# Altium project ZynTra.PrjPcb (part 2 of 2)

## Sheet 8_Zyntra-Ethernet.SchDoc
size 406 x 241 mm; SheetNumber: 8; SheetTotal: 10
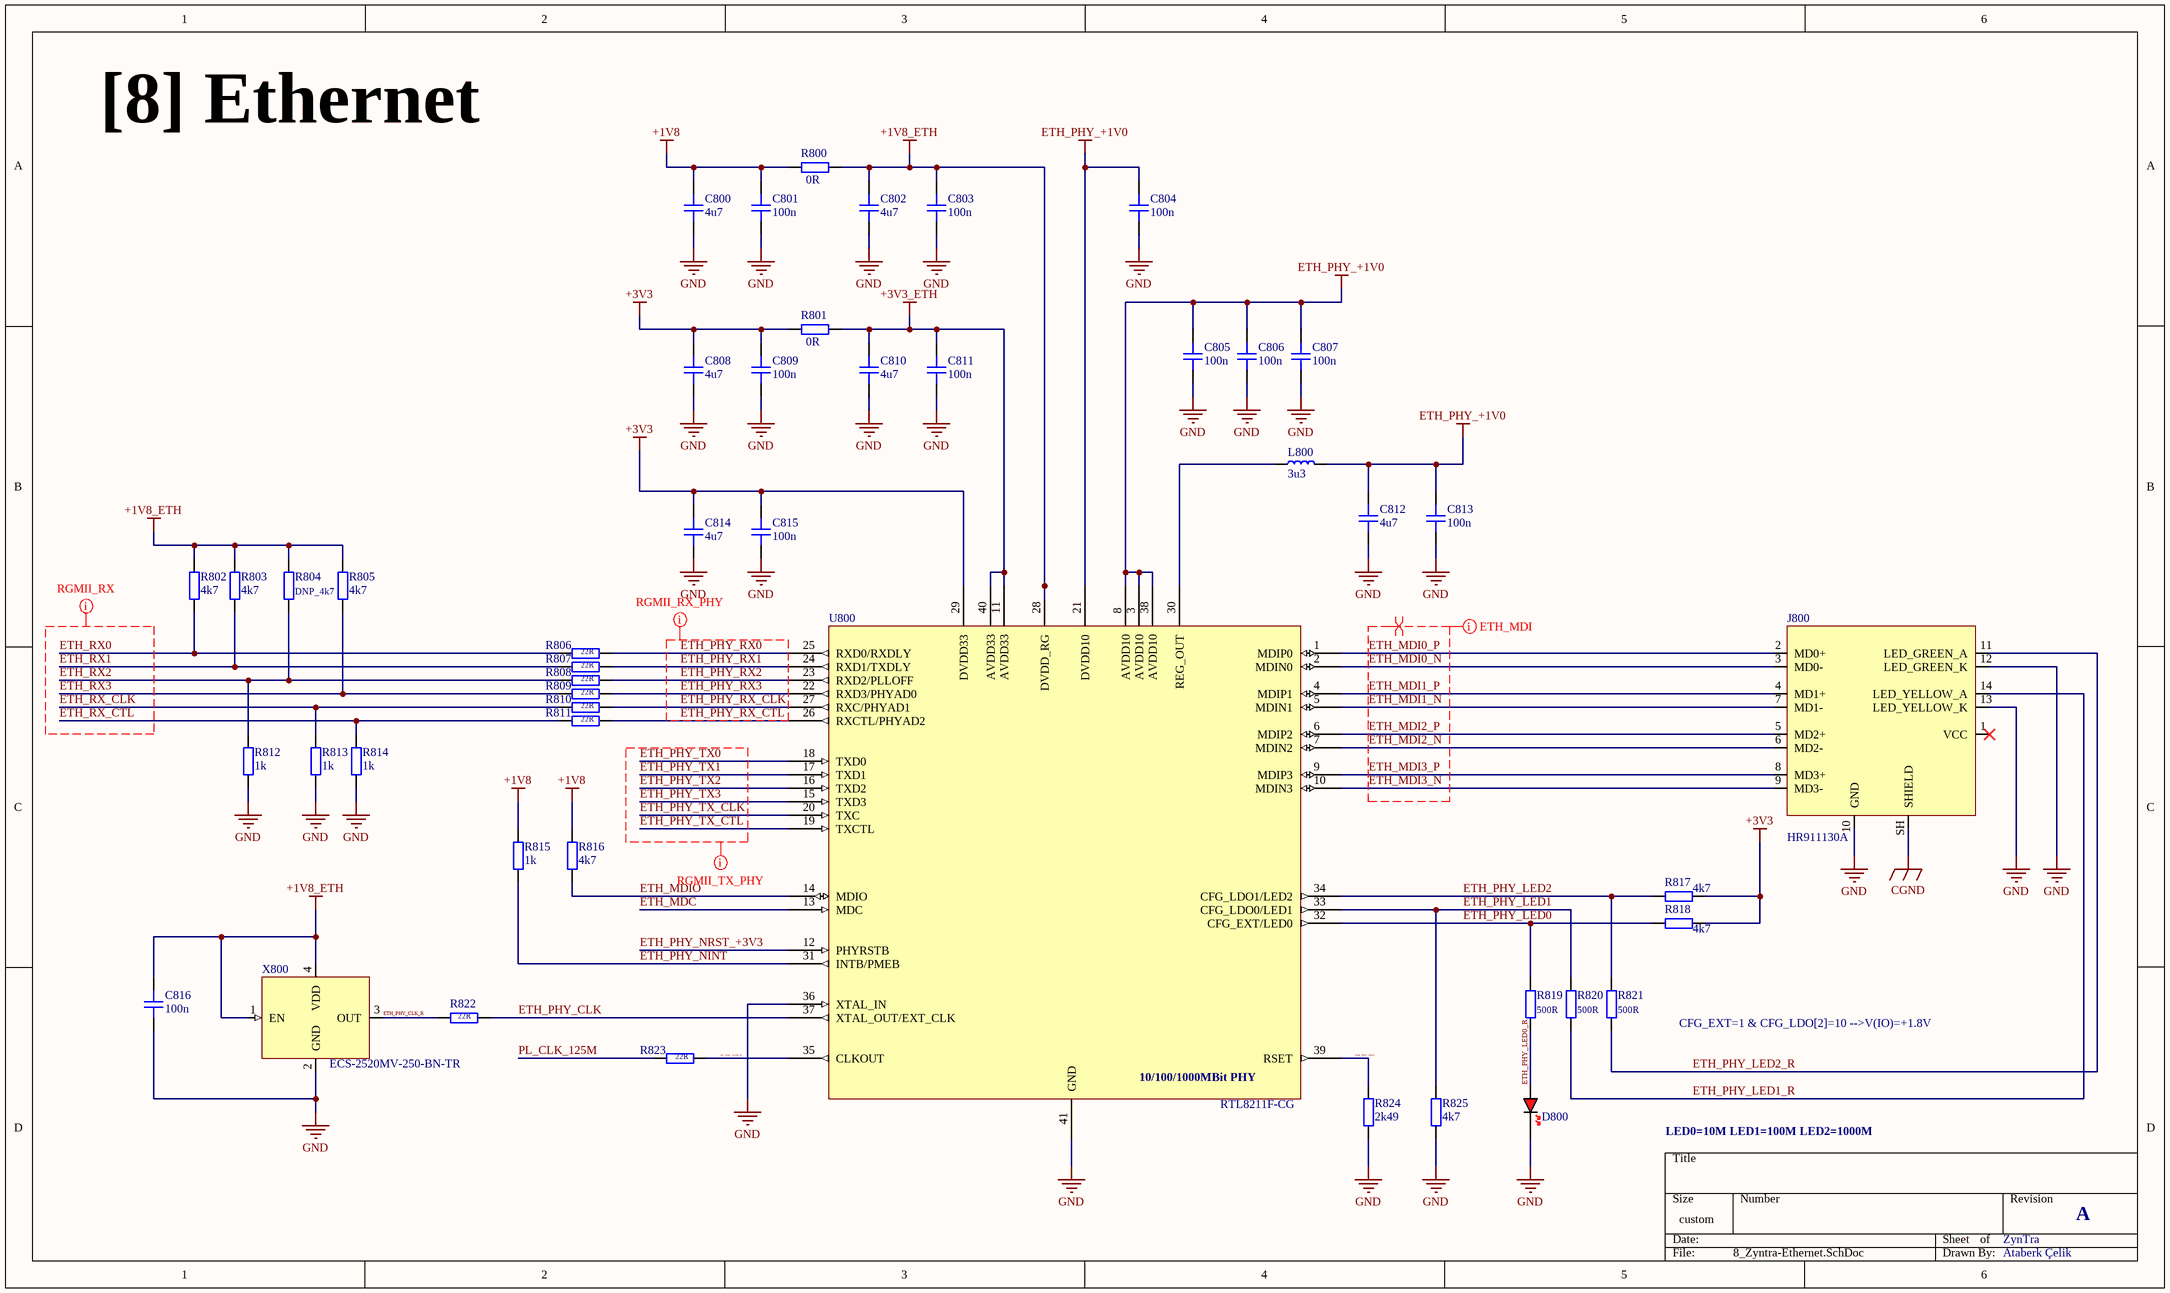
[diagram p7: 8_Zyntra-Ethernet.SchDoc]

### Parts
C800  4u7  [CAP_0201]
C801  100n  [CAP_0201]
C802  4u7  [CAP_0201]
C803  100n  [CAP_0201]
C804  100n  [CAP_0201]
C805  100n  [CAP_0201]
C806  100n  [CAP_0201]
C807  100n  [CAP_0201]
C808  4u7  [CAP_0201]
C809  100n  [CAP_0201]
C810  4u7  [CAP_0201]
C811  100n  [CAP_0201]
C812  4u7  [CAP_0201]
C813  100n  [CAP_0201]
C814  4u7  [CAP_0201]
C815  100n  [CAP_0201]
C816  100n  [CAP_0201]
D800  RED  [LED_0603_RED]  (value not drawn)
J800  HR911130A  [HR911130A]
L800  3u3  [IND_0603]
R800  0R  [RES_0402]
R801  0R  [RES_0402]
R802  4k7  [RES_0402]
R803  4k7  [RES_0402]
R804  DNP_4k7  [RES_0402]
R805  4k7  [RES_0402]
R806  22R  [RES_0402]
R807  22R  [RES_0402]
R808  22R  [RES_0402]
R809  22R  [RES_0402]
R810  22R  [RES_0402]
R811  22R  [RES_0402]
R812  1k  [RES_0402]
R813  1k  [RES_0402]
R814  1k  [RES_0402]
R815  1k  [RES_0402]
R816  4k7  [RES_0402]
R817  4k7  [RES_0402]
R818  4k7  [RES_0402]
R819  500R  [RES_0402]
R820  500R  [RES_0402]
R821  500R  [RES_0402]
R822  22R  [RES_0402]
R823  22R  [RES_0402]
R824  2k49  [RES_0402]
R825  4k7  [RES_0402]
U800  RTL8211F-CG  [QFN40, 5x5mm]
X800  ECS-2520MV-250-BN-TR  [XTAL_2520]

### Nets
+1V8: C800.2 C801.2 R800.1 R815.2 R816.2
+1V8_ETH: C802.2 C803.2 C816.2 R800.2 R802.2 R803.2 R804.2 R805.2 U800.28(DVDD_RG) X800.1(EN) X800.4(VDD)
+3V3: C808.2 C809.2 C814.2 C815.2 R801.1 R817.2 R818.2 U800.29(DVDD33)
+3V3_ETH: C810.2 C811.2 R801.2 U800.11(AVDD33) U800.40(AVDD33)
CGND: J800.SH(SHIELD)
ETH_PHY_+1V0: C804.2 C805.2 C806.2 C807.2 C812.2 C813.2 L800.2 U800.3(AVDD10) U800.8(AVDD10) U800.21(DVDD10) U800.38(AVDD10)
GND: C800.1 C801.1 C802.1 C803.1 C804.1 C805.1 C806.1 C807.1 C808.1 C809.1 C810.1 C811.1 C812.1 C813.1 C814.1 C815.1 C816.1 D800.K J800.10(GND) J800.12(LED_GREEN_K) J800.13(LED_YELLOW_K) R812.1 R813.1 R814.1 R824.2 R825.1 U800.36(XTAL_IN) U800.41(GND) X800.2(GND)
ETH_MDC: U800.13(MDC)
ETH_MDI0_N: J800.3(MD0-) U800.2(MDIN0)
ETH_MDI0_P: J800.2(MD0+) U800.1(MDIP0)
ETH_MDI1_N: J800.7(MD1-) U800.5(MDIN1)
ETH_MDI1_P: J800.4(MD1+) U800.4(MDIP1)
ETH_MDI2_N: J800.6(MD2-) U800.7(MDIN2)
ETH_MDI2_P: J800.5(MD2+) U800.6(MDIP2)
ETH_MDI3_N: J800.9(MD3-) U800.10(MDIN3)
ETH_MDI3_P: J800.8(MD3+) U800.9(MDIP3)
ETH_MDIO: R816.1 U800.14(MDIO)
ETH_PHY_CLK: R822.1 U800.37(XTAL_OUT/EXT_CLK)
ETH_PHY_CLK_R: R822.2 X800.3(OUT)
ETH_PHY_LED0: R818.1 R819.1 U800.32(CFG_EXT/LED0)
ETH_PHY_LED0_R: D800.A R819.2
ETH_PHY_LED1: R820.1 R825.2 U800.33(CFG_LDO0/LED1)
ETH_PHY_LED1_R: J800.14(LED_YELLOW_A) R820.2
ETH_PHY_LED2: R817.1 R821.1 U800.34(CFG_LDO1/LED2)
ETH_PHY_LED2_R: J800.11(LED_GREEN_A) R821.2
ETH_PHY_NINT: R815.1 U800.31(INTB/PMEB)
ETH_PHY_NRST_+3V3: U800.12(PHYRSTB)
ETH_PHY_RSET: R824.1 U800.39(RSET)
ETH_PHY_RX0: R806.1 U800.25(RXD0/RXDLY)
ETH_PHY_RX1: R807.1 U800.24(RXD1/TXDLY)
ETH_PHY_RX2: R808.1 U800.23(RXD2/PLLOFF)
ETH_PHY_RX3: R809.1 U800.22(RXD3/PHYAD0)
ETH_PHY_RX_CLK: R810.1 U800.27(RXC/PHYAD1)
ETH_PHY_RX_CTL: R811.1 U800.26(RXCTL/PHYAD2)
ETH_PHY_TX0: U800.18(TXD0)
ETH_PHY_TX1: U800.17(TXD1)
ETH_PHY_TX2: U800.16(TXD2)
ETH_PHY_TX3: U800.15(TXD3)
ETH_PHY_TX_CLK: U800.20(TXC)
ETH_PHY_TX_CTL: U800.19(TXCTL)
ETH_RX0: R802.1 R806.2
ETH_RX1: R803.1 R807.2
ETH_RX2: R804.1 R808.2 R812.2
ETH_RX3: R805.1 R809.2
ETH_RX_CLK: R810.2 R813.2
ETH_RX_CTL: R811.2 R814.2
PL_CLK_125M: R823.2
PL_CLK_125M_R: R823.1 U800.35(CLKOUT)
NetL800_1: L800.1 U800.30(REG_OUT)

Not connected (* = marked no-connect by the designer): J800 1(VCC)*

### Layout directives
net class ETH_MDI: ETH_MDI0_N, ETH_MDI0_P, ETH_MDI1_N, ETH_MDI1_P, ETH_MDI2_N, ETH_MDI2_P, ETH_MDI3_N, ETH_MDI3_P
differential pair: ETH_MDI0_N, ETH_MDI0_P, ETH_MDI1_N, ETH_MDI1_P, ETH_MDI2_N, ETH_MDI2_P, ETH_MDI3_N, ETH_MDI3_P
net class RGMII_RX; rule Matched Net Lengths [Delay Tolerance = 10ps]: ETH_RX0, ETH_RX1, ETH_RX2, ETH_RX3, ETH_RX_CLK, ETH_RX_CTL
net class RGMII_RX_PHY; rule Matched Net Lengths [Delay Tolerance = 10ps]: ETH_PHY_RX0, ETH_PHY_RX1, ETH_PHY_RX2, ETH_PHY_RX3, ETH_PHY_RX_CLK, ETH_PHY_RX_CTL
net class RGMII_TX_PHY; rule Matched Net Lengths [Delay Tolerance = 10ps]: ETH_PHY_TX0, ETH_PHY_TX1, ETH_PHY_TX2, ETH_PHY_TX3, ETH_PHY_TX_CLK, ETH_PHY_TX_CTL

### Notes on the sheet
- [8] Ethernet
- CFG_EXT=1 & CFG_LDO[2]=10 -->V(IO)=+1.8V
- LED0=10M LED1=100M LED2=1000M
- ZynTra
- A
- Ataberk Çelik
- (in symbol RTL8211F-CG) 10/100/1000MBit PHY

### Library data of the parts
C800-C816 = CAP_0201: Capacitor SMD 0201; Manufacturer: *; Manufacturer Part Number: *; Distributor Link: *; LCSC: *; Rating: *; Dielectric: *
D800 = LED_0603_RED: LED 0603 RED SMD
J800 = HR911130A: 100/1000Base-T Magnetics Single-Port RJ45 Connector with Integrated Magnetics and LEDs; Manufacturer: Hanrun; Manufacturer Part Number: HR911130A
L800 = IND_0603: Inductor SMD 0603
R800-R825 = RES_0402: Resistor SMD 0402; Manufacturer: *; Manufacturer Part Number: *; Distributor Link: *; LCSC: *
U800 = RTL8211F-CG: INTEGRATED 10/100/1000M ETHERNET / PRECISION TRANSCEIVER; Manufacturer: REALTEK; Manufacturer Part Number: RTL8211F-CG; Supplier Link: https://www.lcsc.com/product-detail/C187932.html?s_z=n_RTL8211F&spm=wm.ssy.bg.0.xh&lcsc_vid=TlhdUFxUFlMPVQBfQVRXA1RWFlhcUlVfT1JaVgVWRwcxVlNRQlFWVFRSRVdXUjsOAxUeFF5JWBYZEEoKFBINSQcJGk4eFQsCAgIaFA%3D%3D
X800 = ECS-2520MV-130-BN-TR: as X300 on sheet 3_ZynTra-Zynq-Config; Manufacturer Part Number: ECS-2520MV-130-BN-TR

## Sheet 9_ZynTra-USB2.0.SchDoc
size 381 x 241 mm; SheetNumber: 9; SheetTotal: 10
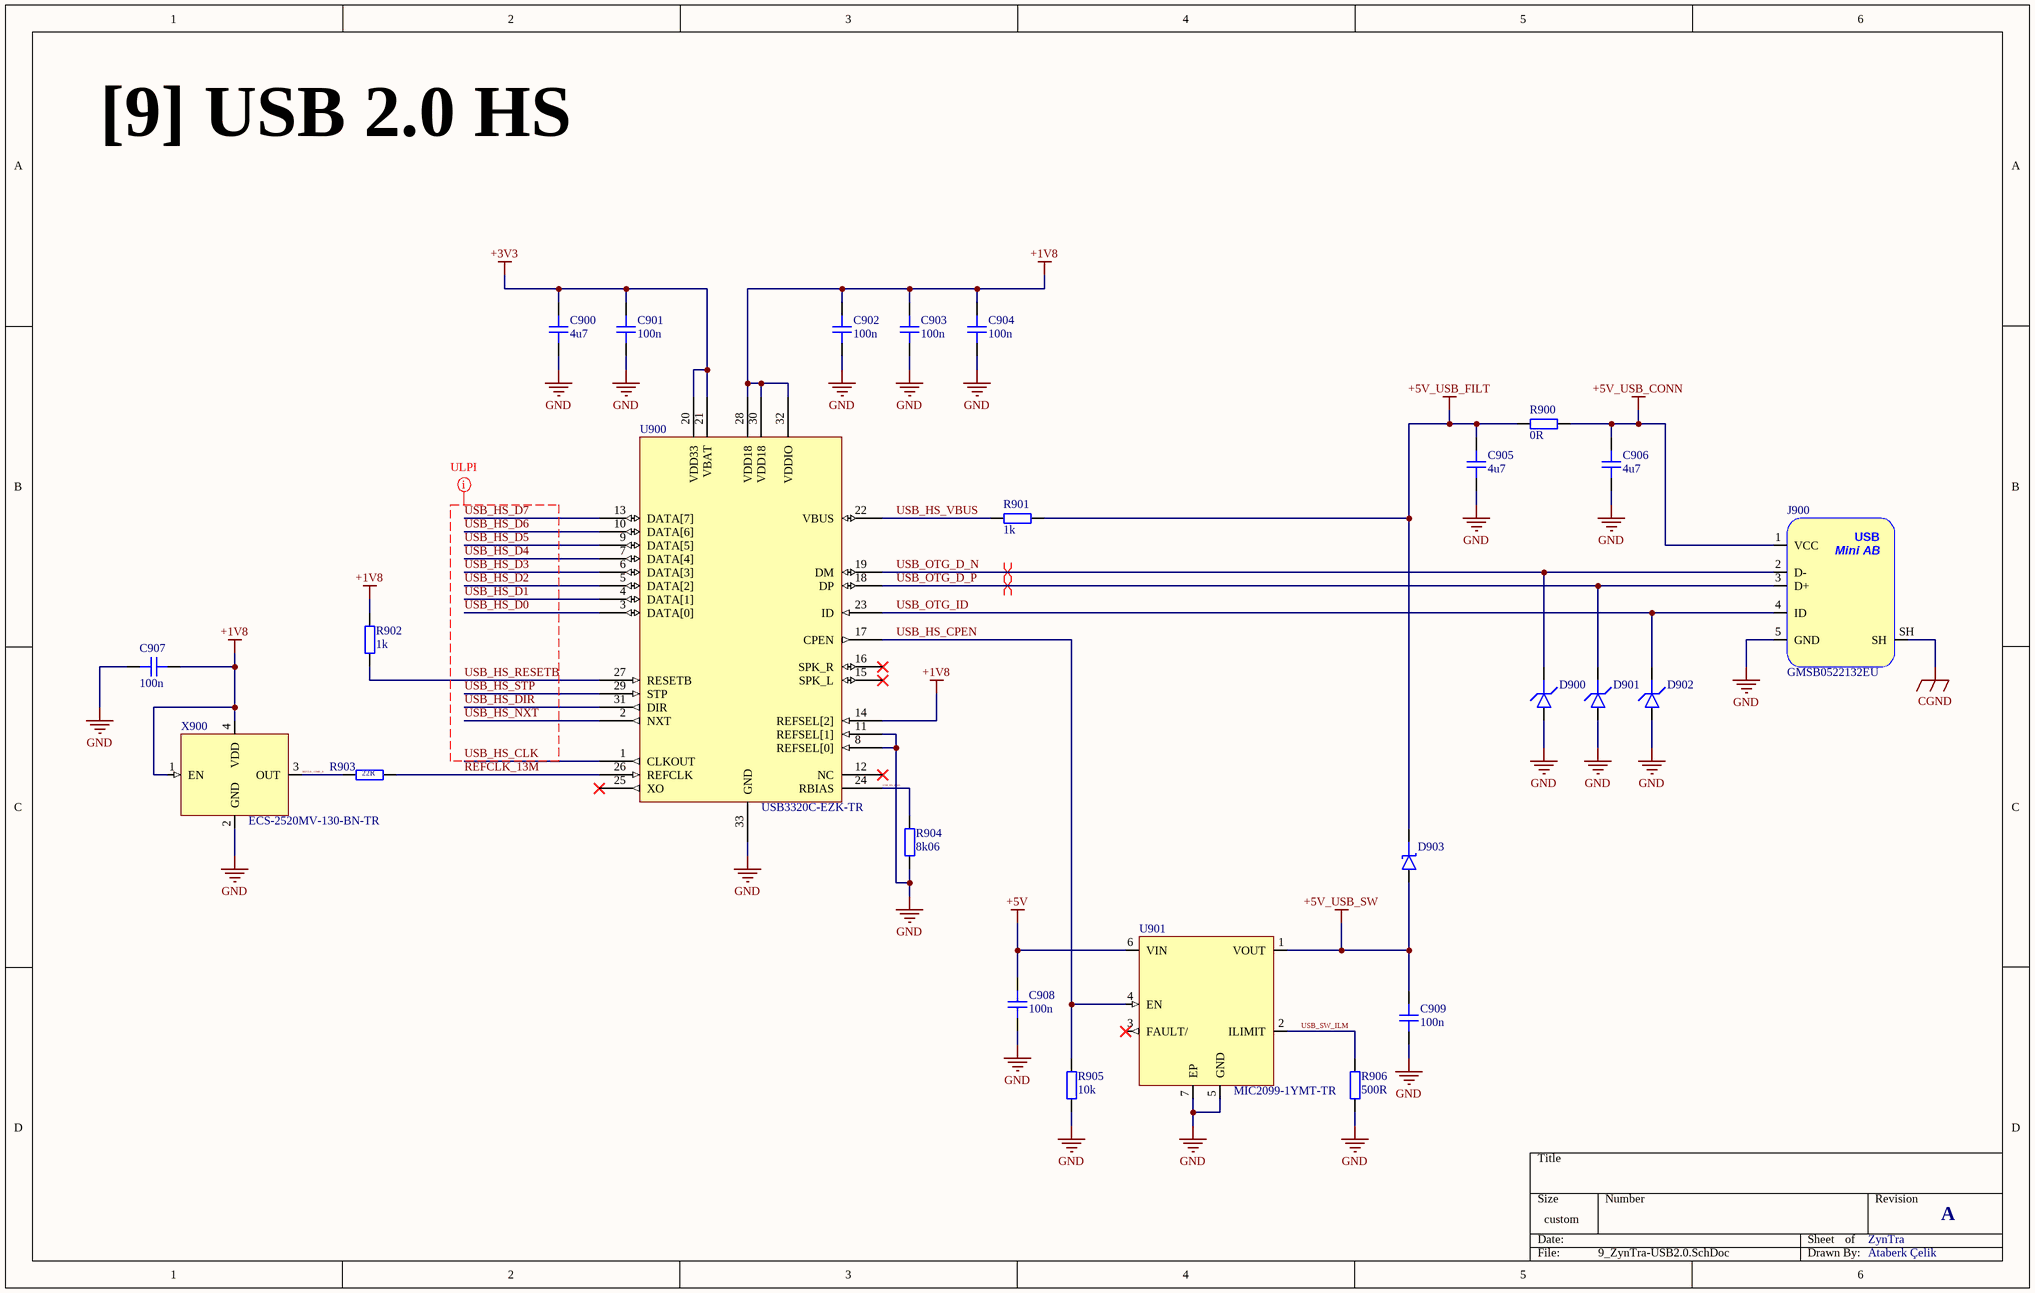
[diagram p8: 9_ZynTra-USB2.0.SchDoc]

### Parts
C900  4u7  [CAP_0402]
C901  100n  [CAP_0201]
C902  100n  [CAP_0201]
C903  100n  [CAP_0201]
C904  100n  [CAP_0201]
C905  4u7  [CAP_0402]
C906  4u7  [CAP_0402]
C907  100n  [CAP_0201]
C908  100n  [CAP_0201]
C909  100n  [CAP_0201]
D900  D_TVS_0402  [D_0402]  (value not drawn)
D901  D_TVS_0402  [D_0402]  (value not drawn)
D902  D_TVS_0402  [D_0402]  (value not drawn)
D903  D_SCHOTTKY_SOD_323  [SOD-323]  (value not drawn)
J900  GMSB0522132EU  [GMSB0522132EU]
R900  0R  [RES_0402]
R901  1k  [RES_0402]
R902  1k  [RES_0402]
R903  22R  [RES_0402]
R904  8k06  [RES_0402]
R905  10k  [RES_0402]
R906  500R  [RES_0402]
U900  USB3320C-EZK-TR  [32-QFN, 5x5mm]
U901  MIC2099-1YMT-TR  [6-1.6x1.6mm TMLF]
X900  ECS-2520MV-130-BN-TR  [XTAL_2520]

### Nets
+1V8: C902.2 C903.2 C904.2 C907.1 R902.2 U900.14(REFSEL[2]) U900.28(VDD18) U900.30(VDD18) U900.32(VDDIO) X900.1(EN) X900.4(VDD)
+3V3: C900.2 C901.2 U900.20(VDD33) U900.21(VBAT)
+5V: C908.2 U901.6(VIN)
+5V_USB_CONN: C906.2 J900.1(VCC) R900.2
+5V_USB_FILT: C905.2 D903.K R900.1 R901.2
+5V_USB_SW: C909.2 D903.A U901.1(VOUT)
CGND: J900.SH
GND: C900.1 C901.1 C902.1 C903.1 C904.1 C905.1 C906.1 C907.2 C908.1 C909.1 D900.A D901.A D902.A J900.5(GND) R904.2 R905.2 R906.2 U900.8(REFSEL[0]) U900.11(REFSEL[1]) U900.33(GND) U901.5(GND) U901.7(EP) X900.2(GND)
REFCLK_13M: R903.2 U900.26(REFCLK)
REFCLK_13MH_R: R903.1 X900.3(OUT)
USB_HS_BIAS: R904.1 U900.24(RBIAS)
USB_HS_CLK: U900.1(CLKOUT)
USB_HS_CPEN: R905.1 U900.17(CPEN) U901.4(EN)
USB_HS_D0: U900.3(DATA[0])
USB_HS_D1: U900.4(DATA[1])
USB_HS_D2: U900.5(DATA[2])
USB_HS_D3: U900.6(DATA[3])
USB_HS_D4: U900.7(DATA[4])
USB_HS_D5: U900.9(DATA[5])
USB_HS_D6: U900.10(DATA[6])
USB_HS_D7: U900.13(DATA[7])
USB_HS_DIR: U900.31(DIR)
USB_HS_NXT: U900.2(NXT)
USB_HS_RESETB: R902.1 U900.27(RESETB)
USB_HS_STP: U900.29(STP)
USB_HS_VBUS: R901.1 U900.22(VBUS)
USB_OTG_D_N: D900.K J900.2(D-) U900.19(DM)
USB_OTG_D_P: D901.K J900.3(D+) U900.18(DP)
USB_OTG_ID: D902.K J900.4(ID) U900.23(ID)
USB_SW_ILM: R906.1 U901.2(ILIMIT)

Not connected (* = marked no-connect by the designer): U900 12(NC)* 15(SPK_L)* 16(SPK_R)* 25(XO)*; U901 3(FAULT/)*

### Layout directives
differential pair: USB_OTG_D_N, USB_OTG_D_P
net class ULPI; rule Matched Net Lengths [Delay Tolerance = 10ps]: USB_HS_CLK, USB_HS_D0, USB_HS_D1, USB_HS_D2, USB_HS_D3, USB_HS_D4, USB_HS_D5, USB_HS_D6, USB_HS_D7, USB_HS_DIR, USB_HS_NXT, USB_HS_RESETB, USB_HS_STP

### Notes on the sheet
- [9] USB 2.0 HS
- ZynTra
- A
- Ataberk Çelik
- (in symbol GMSB0522132EU) USB; Mini AB

### Library data of the parts
C900 C905 C906 = CAP_0402: Capacitor SMD 0402; Manufacturer: *; Manufacturer Part Number: *; Distributor Link: *; LCSC: *; Rating: *; Dielectric: *
C901-C904 C907-C909 = CAP_0201: Capacitor SMD 0201; Manufacturer: *; Manufacturer Part Number: *; Distributor Link: *; LCSC: *; Rating: *; Dielectric: *
D900-D902 = D_TVS_0402: Diode TVS / ESD 0402
D903 = D_SCHOTTKY_SOD_323: Diode Schottky SMD SOD-323
J900 = GMSB0522132EU: USB 2.0 Mini AB Receptacle Right Angle Through-Hole; Manufacturer: Amphenol; Manufacturer Part Number: GMSB0522132EU
R900-R906 = RES_0402: Resistor SMD 0402; Manufacturer: *; Manufacturer Part Number: *; Distributor Link: *; LCSC: *
U900 = USB3320C-EZK-TR: Highly Integrated Full Featured Hi-Speed USB 2.0 ULPI / Transceiver; Manufacturer: Microchip; Manufacturer Part Number: USB3320C-EZK-TR; Supplier Link: https://www.mouser.com.tr/ProductDetail/Microchip-Technology/USB3320C-EZK-TR?qs=pA5MXup5wxFLWWzXkMzUXA%3D%3D
U901 = MIC2099-1YMT-TR: Manufacturer: Microchip; Manufacturer Part Number: MIC2099-1YMT-TR; Supplier Link: https://www.mouser.com.tr/ProductDetail/Microchip-Technology/MIC2099-1YMT-TR?qs=Y3Q3JoKAO1TOfJDYcM%252BPYw%3D%3D
X900 = ECS-2520MV-130-BN-TR: Standard Clock Oscillators XO (Standard),13MHz,Standby (Power Down),CMOS, Multi-Volt,1.6 V 3.6 V,+/-50ppm,-40 C 85 C,6mA,Surface Mount,4-SMD, No Lead,(2.50mm x 2.00mm),(0.80mm); Manufacturer: ECS; Manufacturer Part Number: ECS-2520MV-130-BN-TR

## Sheet 10_ZynTra-Connectors.SchDoc
size 241 x 203 mm; SheetNumber: 10; SheetTotal: 10
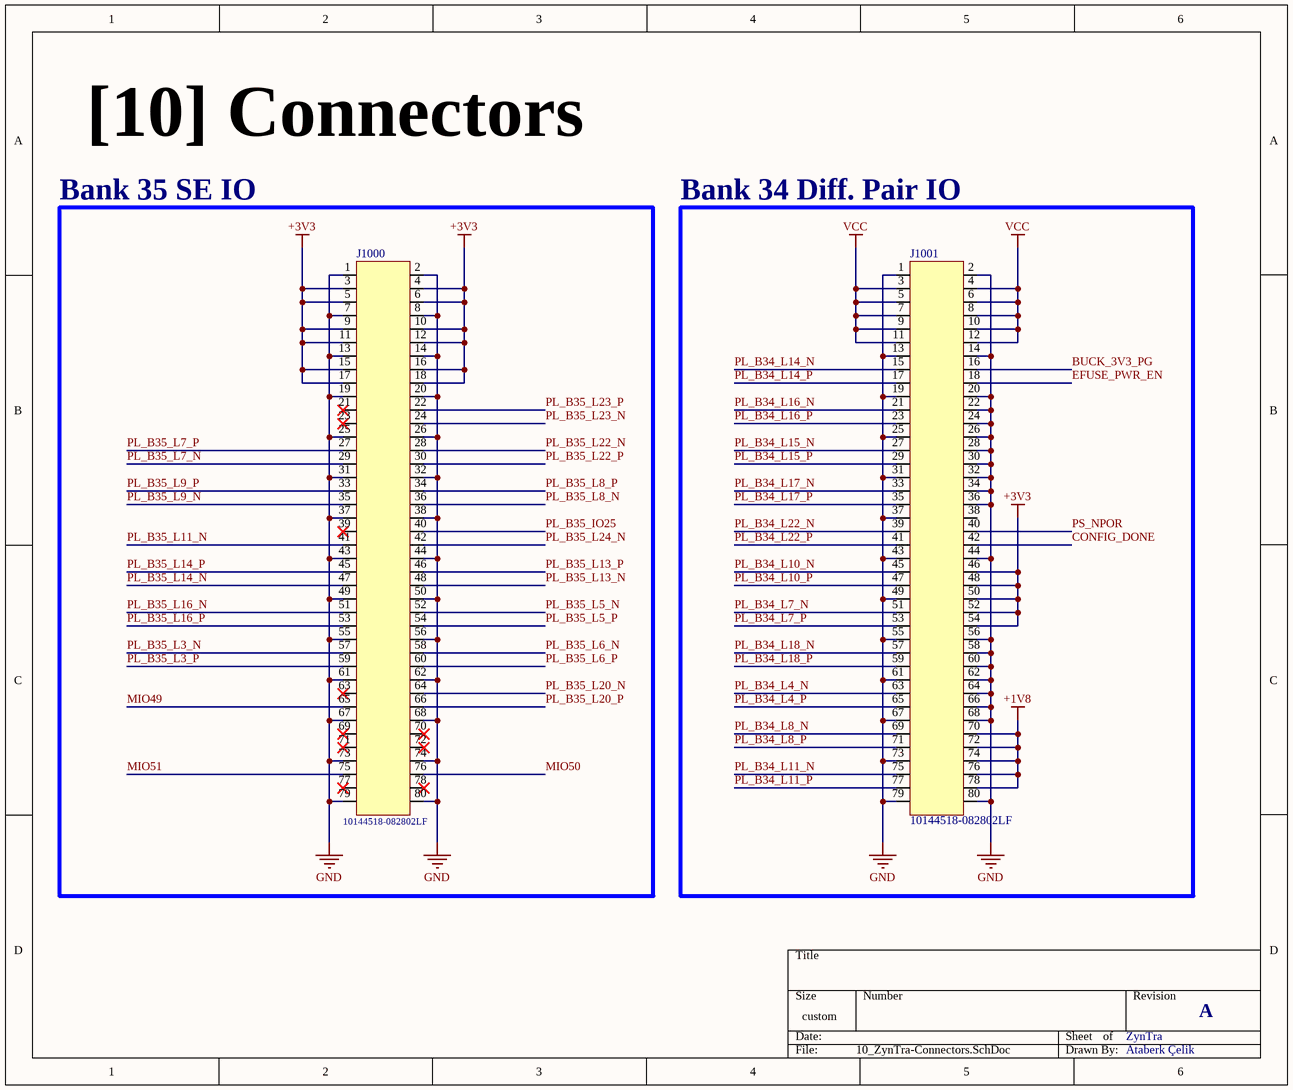
[diagram p9: 10_ZynTra-Connectors.SchDoc]

### Parts
J1000  10144518-082802LF  [10144518-082802LF]
J1001  10144518-082802LF  [10144518-082802LF]

### Blocks framed on the sheet
Bank 35 SE IO: J1000
Bank 34 Diff. Pair IO: J1001

### Nets
+1V8: J1001.70 J1001.72 J1001.74 J1001.76 J1001.78
+3V3: J1000.3 J1000.4 J1000.5 J1000.6 J1000.9 J1000.10 J1000.11 J1000.12 J1000.15 J1000.16 J1000.17 J1000.18 J1001.46 J1001.48 J1001.50 J1001.52 J1001.54
GND: J1000.1 J1000.2 J1000.7 J1000.8 J1000.13 J1000.14 J1000.19 J1000.20 J1000.25 J1000.26 J1000.31 J1000.32 J1000.37 J1000.38 J1000.43 J1000.44 J1000.49 J1000.50 J1000.55 J1000.56 J1000.61 J1000.62 J1000.67 J1000.68 J1000.73 J1000.74 J1000.79 J1000.80 J1001.1 J1001.2 J1001.13 J1001.14 J1001.19 J1001.20 J1001.22 J1001.24 J1001.25 J1001.26 J1001.28 J1001.30 J1001.31 J1001.32 J1001.34 J1001.36 J1001.37 J1001.43 J1001.44 J1001.49 J1001.55 J1001.56 J1001.58 J1001.60 J1001.61 J1001.62 J1001.64 J1001.66 J1001.67 J1001.68 J1001.73 J1001.79 J1001.80
VCC: J1001.3 J1001.4 J1001.5 J1001.6 J1001.7 J1001.8 J1001.9 J1001.10 J1001.11 J1001.12
BUCK_3V3_PG: J1001.16
CONFIG_DONE: J1001.42
EFUSE_PWR_EN: J1001.18
MIO49: J1000.65
MIO50: J1000.76
MIO51: J1000.75
PL_B34_L4_N: J1001.63
PL_B34_L4_P: J1001.65
PL_B34_L7_N: J1001.51
PL_B34_L7_P: J1001.53
PL_B34_L8_N: J1001.69
PL_B34_L8_P: J1001.71
PL_B34_L10_N: J1001.45
PL_B34_L10_P: J1001.47
PL_B34_L11_N: J1001.75
PL_B34_L11_P: J1001.77
PL_B34_L14_N: J1001.15
PL_B34_L14_P: J1001.17
PL_B34_L15_N: J1001.27
PL_B34_L15_P: J1001.29
PL_B34_L16_N: J1001.21
PL_B34_L16_P: J1001.23
PL_B34_L17_N: J1001.33
PL_B34_L17_P: J1001.35
PL_B34_L18_N: J1001.57
PL_B34_L18_P: J1001.59
PL_B34_L22_N: J1001.39
PL_B34_L22_P: J1001.41
PL_B35_IO25: J1000.40
PL_B35_L3_N: J1000.57
PL_B35_L3_P: J1000.59
PL_B35_L5_N: J1000.52
PL_B35_L5_P: J1000.54
PL_B35_L6_N: J1000.58
PL_B35_L6_P: J1000.60
PL_B35_L7_N: J1000.29
PL_B35_L7_P: J1000.27
PL_B35_L8_N: J1000.36
PL_B35_L8_P: J1000.34
PL_B35_L9_N: J1000.35
PL_B35_L9_P: J1000.33
PL_B35_L11_N: J1000.41
PL_B35_L13_N: J1000.48
PL_B35_L13_P: J1000.46
PL_B35_L14_N: J1000.47
PL_B35_L14_P: J1000.45
PL_B35_L16_N: J1000.51
PL_B35_L16_P: J1000.53
PL_B35_L20_N: J1000.64
PL_B35_L20_P: J1000.66
PL_B35_L22_N: J1000.28
PL_B35_L22_P: J1000.30
PL_B35_L23_N: J1000.24
PL_B35_L23_P: J1000.22
PL_B35_L24_N: J1000.42
PS_NPOR: J1001.40

Not connected (* = marked no-connect by the designer): J1000 21* 23* 39* 63* 69* 70* 71* 72* 77* 78*; J1001 38

### Notes on the sheet
- [10] Connectors
- ZynTra
- A
- Ataberk Çelik

### Library data of the parts
J1000 J1001 = 10144518-082802LF: BergStak® Lite 0.80mm, Board-to-Board Connector, 80 Positions, Dual Row, Vertical Header; Manufacturer: Amphenol; Manufacturer Part Number: 10144518-082802LF

## Nets that join several sheets
+0V675: 1_ZynTra-Power (C118.2 U103.3 U103.8), 6_ZynTra-Zynq-DDR Interface (36 pins)
+0V675_REF: 1_ZynTra-Power (C117.2 U103.4), 6_ZynTra-Zynq-DDR Interface (C612.2 C613.2 U200.H6 U200.P6), 7_ZynTra-DDR3L Modules (8 pins)
+1V0: 1_ZynTra-Power (5 pins), 2_ZynTra-Zynq-Power (29 pins)
+1V8: 1_ZynTra-Power (5 pins), 2_ZynTra-Zynq-Power (29 pins), 4_ZynTra-Zynq-PS (R400.1 R401.1), 8_Zyntra-Ethernet (5 pins), 9_ZynTra-USB2.0 (11 pins), 10_ZynTra-Connectors (5 pins)
+1V35: 1_ZynTra-Power (6 pins), 2_ZynTra-Zynq-Power (16 pins), 6_ZynTra-Zynq-DDR Interface (R625.2), 7_ZynTra-DDR3L Modules (78 pins)
+3V3: 1_ZynTra-Power (5 pins), 2_ZynTra-Zynq-Power (38 pins), 3_ZynTra-Zynq-Config (37 pins), 4_ZynTra-Zynq-PS (32 pins), 5_ZynTra-Zynq-PL (R500.1 R501.1), 8_Zyntra-Ethernet (8 pins), 9_ZynTra-USB2.0 (C900.2 C901.2 U900.20 U900.21), 10_ZynTra-Connectors (17 pins)
+5V: 1_ZynTra-Power (22 pins), 9_ZynTra-USB2.0 (C908.2 U901.6)
CGND: 1_ZynTra-Power (C124.1 R121.1), 3_ZynTra-Zynq-Config (J301.6), 8_Zyntra-Ethernet (J800.SH), 9_ZynTra-USB2.0 (J900.SH)
GND: 1_ZynTra-Power (54 pins), 2_ZynTra-Zynq-Power (108 pins), 3_ZynTra-Zynq-Config (48 pins), 4_ZynTra-Zynq-PS (31 pins), 5_ZynTra-Zynq-PL (Q500.S R503.2), 6_ZynTra-Zynq-DDR Interface (16 pins), 7_ZynTra-DDR3L Modules (86 pins), 8_Zyntra-Ethernet (29 pins), 9_ZynTra-USB2.0 (23 pins), 10_ZynTra-Connectors (61 pins)
VCC: 1_ZynTra-Power (7 pins), 10_ZynTra-Connectors (10 pins)
BUCK_3V3_PG: 1_ZynTra-Power (5 pins), 4_ZynTra-Zynq-PS (U402.2), 10_ZynTra-Connectors (J1001.16)
CONFIG_DONE: 3_ZynTra-Zynq-Config (R313.1 U200.R11), 10_ZynTra-Connectors (J1001.42)
EFUSE_PWR_EN: 1_ZynTra-Power (C106.2 R101.1 U100.7), 10_ZynTra-Connectors (J1001.18)
ETH_MDC: 4_ZynTra-Zynq-PS (U200.C10), 8_Zyntra-Ethernet (U800.13)
ETH_MDIO: 4_ZynTra-Zynq-PS (U200.C11), 8_Zyntra-Ethernet (R816.1 U800.14)
ETH_PHY_NINT: 4_ZynTra-Zynq-PS (U200.E12), 8_Zyntra-Ethernet (R815.1 U800.31)
ETH_PHY_NRST_+3V3: 4_ZynTra-Zynq-PS (R422.2 U404.4), 8_Zyntra-Ethernet (U800.12)
ETH_PHY_TX0: 4_ZynTra-Zynq-PS (R416.1), 8_Zyntra-Ethernet (U800.18)
ETH_PHY_TX1: 4_ZynTra-Zynq-PS (R417.1), 8_Zyntra-Ethernet (U800.17)
ETH_PHY_TX2: 4_ZynTra-Zynq-PS (R418.1), 8_Zyntra-Ethernet (U800.16)
ETH_PHY_TX3: 4_ZynTra-Zynq-PS (R419.1), 8_Zyntra-Ethernet (U800.15)
ETH_PHY_TX_CLK: 4_ZynTra-Zynq-PS (R415.1), 8_Zyntra-Ethernet (U800.20)
ETH_PHY_TX_CTL: 4_ZynTra-Zynq-PS (R420.1), 8_Zyntra-Ethernet (U800.19)
ETH_RX0: 4_ZynTra-Zynq-PS (U200.D11), 8_Zyntra-Ethernet (R802.1 R806.2)
ETH_RX1: 4_ZynTra-Zynq-PS (U200.A16), 8_Zyntra-Ethernet (R803.1 R807.2)
ETH_RX2: 4_ZynTra-Zynq-PS (U200.F15), 8_Zyntra-Ethernet (R804.1 R808.2 R812.2)
ETH_RX3: 4_ZynTra-Zynq-PS (U200.A15), 8_Zyntra-Ethernet (R805.1 R809.2)
ETH_RX_CLK: 4_ZynTra-Zynq-PS (U200.B17), 8_Zyntra-Ethernet (R810.2 R813.2)
ETH_RX_CTL: 4_ZynTra-Zynq-PS (U200.D13), 8_Zyntra-Ethernet (R811.2 R814.2)
MIO49: 4_ZynTra-Zynq-PS (U200.C12), 10_ZynTra-Connectors (J1000.65)
MIO50: 4_ZynTra-Zynq-PS (U200.B13), 10_ZynTra-Connectors (J1000.76)
MIO51: 4_ZynTra-Zynq-PS (U200.B9), 10_ZynTra-Connectors (J1000.75)
PL_B34_L4_N: 5_ZynTra-Zynq-PL (U200.W13), 10_ZynTra-Connectors (J1001.63)
PL_B34_L4_P: 5_ZynTra-Zynq-PL (U200.V12), 10_ZynTra-Connectors (J1001.65)
PL_B34_L7_N: 5_ZynTra-Zynq-PL (U200.Y17), 10_ZynTra-Connectors (J1001.51)
PL_B34_L7_P: 5_ZynTra-Zynq-PL (U200.Y16), 10_ZynTra-Connectors (J1001.53)
PL_B34_L8_N: 5_ZynTra-Zynq-PL (U200.Y14), 10_ZynTra-Connectors (J1001.69)
PL_B34_L8_P: 5_ZynTra-Zynq-PL (U200.W14), 10_ZynTra-Connectors (J1001.71)
PL_B34_L10_N: 5_ZynTra-Zynq-PL (U200.W15), 10_ZynTra-Connectors (J1001.45)
PL_B34_L10_P: 5_ZynTra-Zynq-PL (U200.V15), 10_ZynTra-Connectors (J1001.47)
PL_B34_L11_N: 5_ZynTra-Zynq-PL (U200.U15), 10_ZynTra-Connectors (J1001.75)
PL_B34_L11_P: 5_ZynTra-Zynq-PL (U200.U14), 10_ZynTra-Connectors (J1001.77)
PL_B34_L14_N: 5_ZynTra-Zynq-PL (U200.P20), 10_ZynTra-Connectors (J1001.15)
PL_B34_L14_P: 5_ZynTra-Zynq-PL (U200.N20), 10_ZynTra-Connectors (J1001.17)
PL_B34_L15_N: 5_ZynTra-Zynq-PL (U200.U20), 10_ZynTra-Connectors (J1001.27)
PL_B34_L15_P: 5_ZynTra-Zynq-PL (U200.T20), 10_ZynTra-Connectors (J1001.29)
PL_B34_L16_N: 5_ZynTra-Zynq-PL (U200.W20), 10_ZynTra-Connectors (J1001.21)
PL_B34_L16_P: 5_ZynTra-Zynq-PL (U200.V20), 10_ZynTra-Connectors (J1001.23)
PL_B34_L17_N: 5_ZynTra-Zynq-PL (U200.Y19), 10_ZynTra-Connectors (J1001.33)
PL_B34_L17_P: 5_ZynTra-Zynq-PL (U200.Y18), 10_ZynTra-Connectors (J1001.35)
PL_B34_L18_N: 5_ZynTra-Zynq-PL (U200.W16), 10_ZynTra-Connectors (J1001.57)
PL_B34_L18_P: 5_ZynTra-Zynq-PL (U200.V16), 10_ZynTra-Connectors (J1001.59)
PL_B34_L22_N: 5_ZynTra-Zynq-PL (U200.W19), 10_ZynTra-Connectors (J1001.39)
PL_B34_L22_P: 5_ZynTra-Zynq-PL (U200.W18), 10_ZynTra-Connectors (J1001.41)
PL_B35_IO25: 5_ZynTra-Zynq-PL (U200.J15), 10_ZynTra-Connectors (J1000.40)
PL_B35_L3_N: 5_ZynTra-Zynq-PL (U200.D18), 10_ZynTra-Connectors (J1000.57)
PL_B35_L3_P: 5_ZynTra-Zynq-PL (U200.E17), 10_ZynTra-Connectors (J1000.59)
PL_B35_L5_N: 5_ZynTra-Zynq-PL (U200.E19), 10_ZynTra-Connectors (J1000.52)
PL_B35_L5_P: 5_ZynTra-Zynq-PL (U200.E18), 10_ZynTra-Connectors (J1000.54)
PL_B35_L6_N: 5_ZynTra-Zynq-PL (U200.F17), 10_ZynTra-Connectors (J1000.58)
PL_B35_L6_P: 5_ZynTra-Zynq-PL (U200.F16), 10_ZynTra-Connectors (J1000.60)
PL_B35_L7_N: 5_ZynTra-Zynq-PL (U200.M20), 10_ZynTra-Connectors (J1000.29)
PL_B35_L7_P: 5_ZynTra-Zynq-PL (U200.M19), 10_ZynTra-Connectors (J1000.27)
PL_B35_L8_N: 5_ZynTra-Zynq-PL (U200.M18), 10_ZynTra-Connectors (J1000.36)
PL_B35_L8_P: 5_ZynTra-Zynq-PL (U200.M17), 10_ZynTra-Connectors (J1000.34)
PL_B35_L9_N: 5_ZynTra-Zynq-PL (U200.L20), 10_ZynTra-Connectors (J1000.35)
PL_B35_L9_P: 5_ZynTra-Zynq-PL (U200.L19), 10_ZynTra-Connectors (J1000.33)
PL_B35_L11_N: 5_ZynTra-Zynq-PL (U200.L17), 10_ZynTra-Connectors (J1000.41)
PL_B35_L13_N: 5_ZynTra-Zynq-PL (U200.H17), 10_ZynTra-Connectors (J1000.48)
PL_B35_L13_P: 5_ZynTra-Zynq-PL (U200.H16), 10_ZynTra-Connectors (J1000.46)
PL_B35_L14_N: 5_ZynTra-Zynq-PL (U200.H18), 10_ZynTra-Connectors (J1000.47)
PL_B35_L14_P: 5_ZynTra-Zynq-PL (U200.J18), 10_ZynTra-Connectors (J1000.45)
PL_B35_L16_N: 5_ZynTra-Zynq-PL (U200.G18), 10_ZynTra-Connectors (J1000.51)
PL_B35_L16_P: 5_ZynTra-Zynq-PL (U200.G17), 10_ZynTra-Connectors (J1000.53)
PL_B35_L20_N: 5_ZynTra-Zynq-PL (U200.J14), 10_ZynTra-Connectors (J1000.64)
PL_B35_L20_P: 5_ZynTra-Zynq-PL (U200.K14), 10_ZynTra-Connectors (J1000.66)
PL_B35_L22_N: 5_ZynTra-Zynq-PL (U200.L15), 10_ZynTra-Connectors (J1000.28)
PL_B35_L22_P: 5_ZynTra-Zynq-PL (U200.L14), 10_ZynTra-Connectors (J1000.30)
PL_B35_L23_N: 5_ZynTra-Zynq-PL (U200.M15), 10_ZynTra-Connectors (J1000.24)
PL_B35_L23_P: 5_ZynTra-Zynq-PL (U200.M14), 10_ZynTra-Connectors (J1000.22)
PL_B35_L24_N: 5_ZynTra-Zynq-PL (U200.J16), 10_ZynTra-Connectors (J1000.42)
PL_CLK_125M: 5_ZynTra-Zynq-PL (U200.K17), 8_Zyntra-Ethernet (R823.2)
PS_DDR_A0: 6_ZynTra-Zynq-DDR Interface (R602.1 U200.N2), 7_ZynTra-DDR3L Modules (U700.N3 U701.N3)
PS_DDR_A1: 6_ZynTra-Zynq-DDR Interface (R603.1 U200.K2), 7_ZynTra-DDR3L Modules (U700.P7 U701.P7)
PS_DDR_A2: 6_ZynTra-Zynq-DDR Interface (R604.1 U200.M3), 7_ZynTra-DDR3L Modules (U700.P3 U701.P3)
PS_DDR_A3: 6_ZynTra-Zynq-DDR Interface (R605.1 U200.K3), 7_ZynTra-DDR3L Modules (U700.N2 U701.N2)
PS_DDR_A4: 6_ZynTra-Zynq-DDR Interface (R606.1 U200.M4), 7_ZynTra-DDR3L Modules (U700.P8 U701.P8)
PS_DDR_A5: 6_ZynTra-Zynq-DDR Interface (R607.1 U200.L1), 7_ZynTra-DDR3L Modules (U700.P2 U701.P2)
PS_DDR_A6: 6_ZynTra-Zynq-DDR Interface (R608.1 U200.L4), 7_ZynTra-DDR3L Modules (U700.R8 U701.R8)
PS_DDR_A7: 6_ZynTra-Zynq-DDR Interface (R609.1 U200.K4), 7_ZynTra-DDR3L Modules (U700.R2 U701.R2)
PS_DDR_A8: 6_ZynTra-Zynq-DDR Interface (R610.1 U200.K1), 7_ZynTra-DDR3L Modules (U700.T8 U701.T8)
PS_DDR_A9: 6_ZynTra-Zynq-DDR Interface (R611.1 U200.J4), 7_ZynTra-DDR3L Modules (U700.R3 U701.R3)
PS_DDR_A10: 6_ZynTra-Zynq-DDR Interface (R612.1 U200.F5), 7_ZynTra-DDR3L Modules (U700.L7 U701.L7)
PS_DDR_A11: 6_ZynTra-Zynq-DDR Interface (R613.1 U200.G4), 7_ZynTra-DDR3L Modules (U700.R7 U701.R7)
PS_DDR_A12: 6_ZynTra-Zynq-DDR Interface (R614.1 U200.E4), 7_ZynTra-DDR3L Modules (U700.N7 U701.N7)
PS_DDR_A13: 6_ZynTra-Zynq-DDR Interface (R615.1 U200.D4), 7_ZynTra-DDR3L Modules (U700.T3 U701.T3)
PS_DDR_A14: 6_ZynTra-Zynq-DDR Interface (R616.1 U200.F4), 7_ZynTra-DDR3L Modules (U700.T7 U701.T7)
PS_DDR_BA0: 6_ZynTra-Zynq-DDR Interface (R622.1 U200.L5), 7_ZynTra-DDR3L Modules (U700.M2 U701.M2)
PS_DDR_BA1: 6_ZynTra-Zynq-DDR Interface (R623.1 U200.R4), 7_ZynTra-DDR3L Modules (U700.N8 U701.N8)
PS_DDR_BA2: 6_ZynTra-Zynq-DDR Interface (R624.1 U200.J5), 7_ZynTra-DDR3L Modules (U700.M3 U701.M3)
PS_DDR_CAS_B: 6_ZynTra-Zynq-DDR Interface (R618.1 U200.P5), 7_ZynTra-DDR3L Modules (U700.K3 U701.K3)
PS_DDR_CK_EN: 6_ZynTra-Zynq-DDR Interface (R601.1 U200.N3), 7_ZynTra-DDR3L Modules (U700.K9 U701.K9)
PS_DDR_CK_N: 6_ZynTra-Zynq-DDR Interface (R600.1 U200.M2), 7_ZynTra-DDR3L Modules (U700.K7 U701.K7)
PS_DDR_CK_P: 6_ZynTra-Zynq-DDR Interface (R600.2 U200.L2), 7_ZynTra-DDR3L Modules (U700.J7 U701.J7)
PS_DDR_CS_B: 6_ZynTra-Zynq-DDR Interface (R620.1 U200.N1), 7_ZynTra-DDR3L Modules (U700.L2 U701.L2)
PS_DDR_DM0: 6_ZynTra-Zynq-DDR Interface (U200.A1), 7_ZynTra-DDR3L Modules (U700.E7)
PS_DDR_DM1: 6_ZynTra-Zynq-DDR Interface (U200.F1), 7_ZynTra-DDR3L Modules (U700.D3)
PS_DDR_DM2: 6_ZynTra-Zynq-DDR Interface (U200.T1), 7_ZynTra-DDR3L Modules (U701.E7)
PS_DDR_DM3: 6_ZynTra-Zynq-DDR Interface (U200.Y1), 7_ZynTra-DDR3L Modules (U701.D3)
PS_DDR_DQ0: 6_ZynTra-Zynq-DDR Interface (U200.C3), 7_ZynTra-DDR3L Modules (U700.E3)
PS_DDR_DQ1: 6_ZynTra-Zynq-DDR Interface (U200.B3), 7_ZynTra-DDR3L Modules (U700.F7)
PS_DDR_DQ2: 6_ZynTra-Zynq-DDR Interface (U200.A2), 7_ZynTra-DDR3L Modules (U700.F2)
PS_DDR_DQ3: 6_ZynTra-Zynq-DDR Interface (U200.A4), 7_ZynTra-DDR3L Modules (U700.F8)
PS_DDR_DQ4: 6_ZynTra-Zynq-DDR Interface (U200.D3), 7_ZynTra-DDR3L Modules (U700.H3)
PS_DDR_DQ5: 6_ZynTra-Zynq-DDR Interface (U200.D1), 7_ZynTra-DDR3L Modules (U700.H8)
PS_DDR_DQ6: 6_ZynTra-Zynq-DDR Interface (U200.C1), 7_ZynTra-DDR3L Modules (U700.G2)
PS_DDR_DQ7: 6_ZynTra-Zynq-DDR Interface (U200.E1), 7_ZynTra-DDR3L Modules (U700.H7)
PS_DDR_DQ8: 6_ZynTra-Zynq-DDR Interface (U200.E2), 7_ZynTra-DDR3L Modules (U700.D7)
PS_DDR_DQ9: 6_ZynTra-Zynq-DDR Interface (U200.E3), 7_ZynTra-DDR3L Modules (U700.C3)
PS_DDR_DQ10: 6_ZynTra-Zynq-DDR Interface (U200.G3), 7_ZynTra-DDR3L Modules (U700.C8)
PS_DDR_DQ11: 6_ZynTra-Zynq-DDR Interface (U200.H3), 7_ZynTra-DDR3L Modules (U700.C2)
PS_DDR_DQ12: 6_ZynTra-Zynq-DDR Interface (U200.J3), 7_ZynTra-DDR3L Modules (U700.A7)
PS_DDR_DQ13: 6_ZynTra-Zynq-DDR Interface (U200.H2), 7_ZynTra-DDR3L Modules (U700.A2)
PS_DDR_DQ14: 6_ZynTra-Zynq-DDR Interface (U200.H1), 7_ZynTra-DDR3L Modules (U700.B8)
PS_DDR_DQ15: 6_ZynTra-Zynq-DDR Interface (U200.J1), 7_ZynTra-DDR3L Modules (U700.A3)
PS_DDR_DQ16: 6_ZynTra-Zynq-DDR Interface (U200.P1), 7_ZynTra-DDR3L Modules (U701.E3)
PS_DDR_DQ17: 6_ZynTra-Zynq-DDR Interface (U200.P3), 7_ZynTra-DDR3L Modules (U701.F7)
PS_DDR_DQ18: 6_ZynTra-Zynq-DDR Interface (U200.R3), 7_ZynTra-DDR3L Modules (U701.F2)
PS_DDR_DQ19: 6_ZynTra-Zynq-DDR Interface (U200.R1), 7_ZynTra-DDR3L Modules (U701.F8)
PS_DDR_DQ20: 6_ZynTra-Zynq-DDR Interface (U200.T4), 7_ZynTra-DDR3L Modules (U701.H3)
PS_DDR_DQ21: 6_ZynTra-Zynq-DDR Interface (U200.U4), 7_ZynTra-DDR3L Modules (U701.H8)
PS_DDR_DQ22: 6_ZynTra-Zynq-DDR Interface (U200.U2), 7_ZynTra-DDR3L Modules (U701.G2)
PS_DDR_DQ23: 6_ZynTra-Zynq-DDR Interface (U200.U3), 7_ZynTra-DDR3L Modules (U701.H7)
PS_DDR_DQ24: 6_ZynTra-Zynq-DDR Interface (U200.V1), 7_ZynTra-DDR3L Modules (U701.D7)
PS_DDR_DQ25: 6_ZynTra-Zynq-DDR Interface (U200.Y3), 7_ZynTra-DDR3L Modules (U701.C3)
PS_DDR_DQ26: 6_ZynTra-Zynq-DDR Interface (U200.W1), 7_ZynTra-DDR3L Modules (U701.C8)
PS_DDR_DQ27: 6_ZynTra-Zynq-DDR Interface (U200.Y4), 7_ZynTra-DDR3L Modules (U701.C2)
PS_DDR_DQ28: 6_ZynTra-Zynq-DDR Interface (U200.Y2), 7_ZynTra-DDR3L Modules (U701.A7)
PS_DDR_DQ29: 6_ZynTra-Zynq-DDR Interface (U200.W3), 7_ZynTra-DDR3L Modules (U701.A2)
PS_DDR_DQ30: 6_ZynTra-Zynq-DDR Interface (U200.V2), 7_ZynTra-DDR3L Modules (U701.B8)
PS_DDR_DQ31: 6_ZynTra-Zynq-DDR Interface (U200.V3), 7_ZynTra-DDR3L Modules (U701.A3)
PS_DDR_DQS0_N: 6_ZynTra-Zynq-DDR Interface (U200.B2), 7_ZynTra-DDR3L Modules (U700.F3)
PS_DDR_DQS0_P: 6_ZynTra-Zynq-DDR Interface (U200.C2), 7_ZynTra-DDR3L Modules (U700.G3)
PS_DDR_DQS1_N: 6_ZynTra-Zynq-DDR Interface (U200.F2), 7_ZynTra-DDR3L Modules (U700.C7)
PS_DDR_DQS1_P: 6_ZynTra-Zynq-DDR Interface (U200.G2), 7_ZynTra-DDR3L Modules (U700.B7)
PS_DDR_DQS2_N: 6_ZynTra-Zynq-DDR Interface (U200.T2), 7_ZynTra-DDR3L Modules (U701.F3)
PS_DDR_DQS2_P: 6_ZynTra-Zynq-DDR Interface (U200.R2), 7_ZynTra-DDR3L Modules (U701.G3)
PS_DDR_DQS3_N: 6_ZynTra-Zynq-DDR Interface (U200.W5), 7_ZynTra-DDR3L Modules (U701.C7)
PS_DDR_DQS3_P: 6_ZynTra-Zynq-DDR Interface (U200.W4), 7_ZynTra-DDR3L Modules (U701.B7)
PS_DDR_ODT: 6_ZynTra-Zynq-DDR Interface (R621.1 U200.N5), 7_ZynTra-DDR3L Modules (U700.K1 U701.K1)
PS_DDR_RAS_B: 6_ZynTra-Zynq-DDR Interface (R617.1 U200.P4), 7_ZynTra-DDR3L Modules (U700.J3 U701.J3)
PS_DDR_RST_B: 6_ZynTra-Zynq-DDR Interface (R627.2 U200.B4), 7_ZynTra-DDR3L Modules (U700.T2 U701.T2)
PS_DDR_WE_B: 6_ZynTra-Zynq-DDR Interface (R619.1 U200.M5), 7_ZynTra-DDR3L Modules (U700.L3 U701.L3)
PS_NPOR: 3_ZynTra-Zynq-Config (R318.1), 4_ZynTra-Zynq-PS (R403.2 U200.C7 U402.4), 10_ZynTra-Connectors (J1001.40)
PS_QSPI_CLK_R: 3_ZynTra-Zynq-Config (R323.1), 4_ZynTra-Zynq-PS (R405.1 U400.6)
PS_QSPI_IO0: 3_ZynTra-Zynq-Config (R322.1), 4_ZynTra-Zynq-PS (U200.B8 U400.5)
PS_QSPI_M0: 3_ZynTra-Zynq-Config (R336.1), 4_ZynTra-Zynq-PS (U200.A6 U400.7)
PS_QSPI_M1: 3_ZynTra-Zynq-Config (R337.1), 4_ZynTra-Zynq-PS (U200.D6 U400.2)
PS_QSPI_M2: 3_ZynTra-Zynq-Config (R338.1), 4_ZynTra-Zynq-PS (U200.B7 U400.3)
UART1_RX: 3_ZynTra-Zynq-Config (R333.1), 4_ZynTra-Zynq-PS (U200.B5)
UART1_TX_VCFG1: 3_ZynTra-Zynq-Config (R334.1), 4_ZynTra-Zynq-PS (R408.1 U200.D5)
USB_HS_CLK: 4_ZynTra-Zynq-PS (U200.A11), 9_ZynTra-USB2.0 (U900.1)
USB_HS_D0: 4_ZynTra-Zynq-PS (U200.A14), 9_ZynTra-USB2.0 (U900.3)
USB_HS_D1: 4_ZynTra-Zynq-PS (U200.D15), 9_ZynTra-USB2.0 (U900.4)
USB_HS_D2: 4_ZynTra-Zynq-PS (U200.A12), 9_ZynTra-USB2.0 (U900.5)
USB_HS_D3: 4_ZynTra-Zynq-PS (U200.F12), 9_ZynTra-USB2.0 (U900.6)
USB_HS_D4: 4_ZynTra-Zynq-PS (U200.C16), 9_ZynTra-USB2.0 (U900.7)
USB_HS_D5: 4_ZynTra-Zynq-PS (U200.A10), 9_ZynTra-USB2.0 (U900.9)
USB_HS_D6: 4_ZynTra-Zynq-PS (U200.E13), 9_ZynTra-USB2.0 (U900.10)
USB_HS_D7: 4_ZynTra-Zynq-PS (U200.C18), 9_ZynTra-USB2.0 (U900.13)
USB_HS_DIR: 4_ZynTra-Zynq-PS (U200.C13), 9_ZynTra-USB2.0 (U900.31)
USB_HS_NXT: 4_ZynTra-Zynq-PS (U200.E16), 9_ZynTra-USB2.0 (U900.2)
USB_HS_RESETB: 4_ZynTra-Zynq-PS (U200.D14), 9_ZynTra-USB2.0 (R902.1 U900.27)
USB_HS_STP: 4_ZynTra-Zynq-PS (U200.C15), 9_ZynTra-USB2.0 (U900.29)